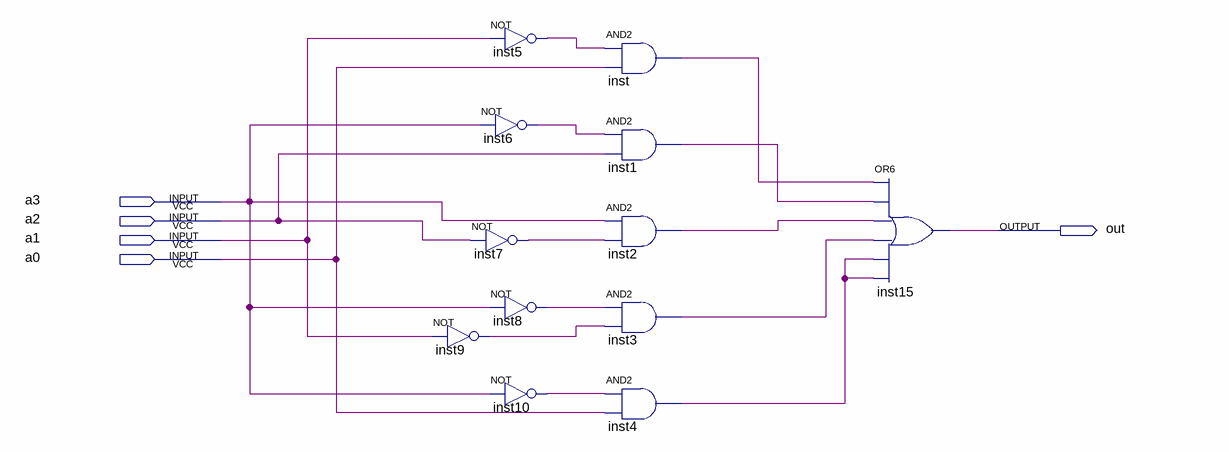
[diagram p0: schematic sheet]
// Quartus schematic FuncC.bdf as structural Verilog: 12 symbols, 5 pins
module FuncC (
  input  a3,
  input  a2,
  input  a1,
  input  a0,
  output out
);

  wire inst1_out, inst2_out, inst3_out, inst4_out, inst5_out, inst6_out, inst7_out, inst8_out, inst9_out,
       inst10_out, inst_out;

  not inst5 (inst5_out, a1);
  not inst6 (inst6_out, a3);
  not inst7 (inst7_out, a2);
  not inst8 (inst8_out, a3);
  not inst9 (inst9_out, a1);
  not inst10 (inst10_out, a3);
  and inst (inst_out, inst5_out, a0);
  and inst1 (inst1_out, inst6_out, a2);
  and inst2 (inst2_out, a3, inst7_out);
  and inst3 (inst3_out, inst8_out, inst9_out);
  and inst4 (inst4_out, inst10_out, a0);
  or inst15 (out, inst_out, inst1_out, inst2_out, inst3_out, inst4_out, inst4_out);
endmodule
